# EAGLE design Driver (EAGLE 8.0.1)
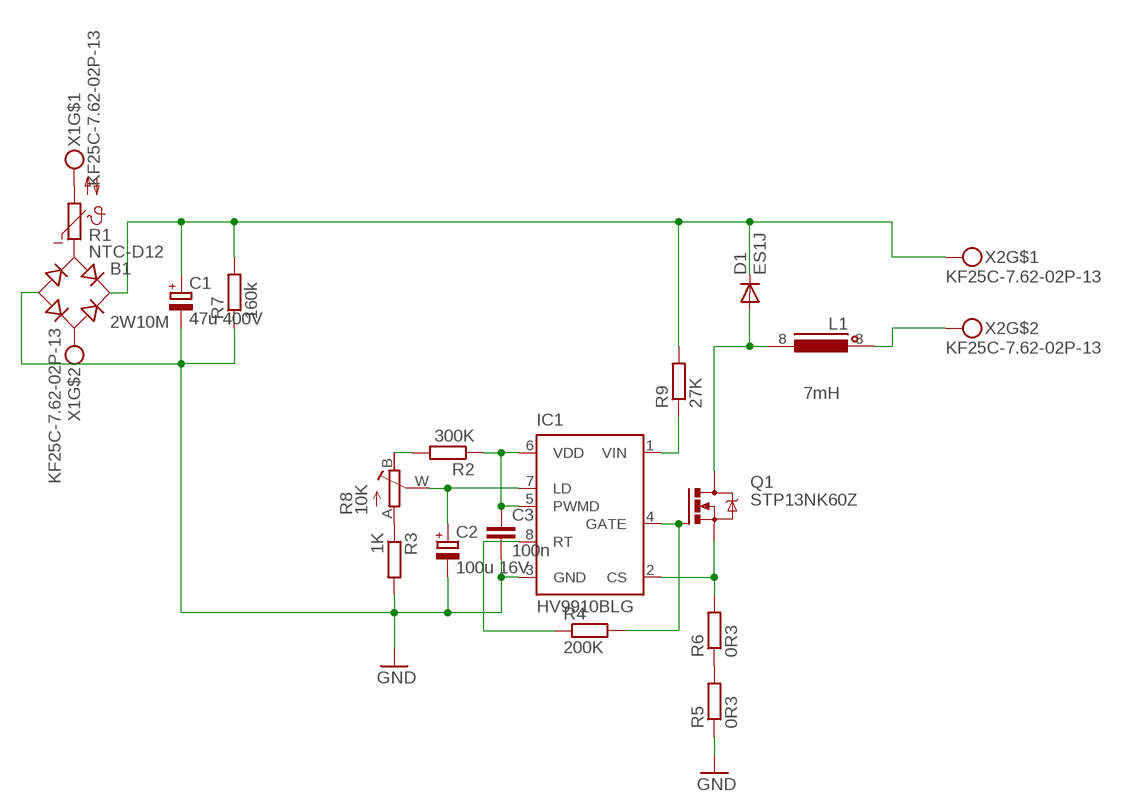
[diagram p0: schematic, sheet 1]

## Parts
B1  2W10M  RB1A  [RB1A]
C1  47u 400V  CPOL-EUE7,5-16-32-H  [E7,5-16-32-HORIZ]
C2  100u 16V  CPOL-EUE2.5-6  [E2,5-6]
C3  100n  C-EUC0805  [C0805]
D1  ES1J  DIODE-DO214AC  [DO214AC]
IC1  HV9910BLG  [SOIC-08LG]
L1  INDUCTOREE20V  [EE20_10PIN]
Q1  STP13NK60Z  IRF740  [TO220BV]
R1  NTC-D12  [NTC-D12]
R2  300K  R-EU_R0805  [R0805]
R3  1K  R-EU_R0805  [R0805]
R4  200K  R-EU_R0805  [R0805]
R5  0R3  R-EU_0414/15  [0414/15]
R6  0R3  R-EU_0414/15  [0414/15]
R7  160k  R-EU_0204/7  [0204/7]
R8  10K  R_POTTURN-X  [RJ9W]
R9  27K  R-EU_0613/15  [P0613/15]
X1  KF25C-7.62-02P-13  [KF25C-7.62-02P-13]
X2  KF25C-7.62-02P-13  [KF25C-7.62-02P-13]

## Nets
300V: B1.+ C1.+ D1.C R7.2 R9.2 X2.P$1
GND: B1.- C1.- C2.- C3.2 IC1.3(GND) R3.2 R5.1 R7.1
N$1: C3.1 IC1.5(PWMD) IC1.6(VDD) R2.1
N$2: R1.2 X1.P$1
N$3: B1.AC2 X1.P$2
N$4: B1.AC1 R1.1
N$6: L1.3 X2.P$2
N$7: C2.+ IC1.7(LD) R8.W(S)
N$8: D1.A L1.8 Q1.D
N$9: IC1.8(RT) R4.1
N$10: IC1.4(GATE) Q1.G R4.2
N$11: R5.2 R6.1
N$12: IC1.2(CS) Q1.S R6.2
N$13: R3.1 R8.A
N$14: R2.2 R8.B(E)
N$16: IC1.1(VIN) R9.1

## Notes on the sheet
- 7mH

## Library data of the parts
B1 = rectifier:RB1A: RECTIFIER 1 A
C1 C2 = rcl:CPOL-EU: POLARIZED CAPACITOR, European symbol
C3 = rcl:C-EU: CAPACITOR, European symbol
D1 = diode:DIODE-: DIODE
IC1 = supertex:HV9910B: Universal High Brightness LED Driver Source: www.supertex.com .. led_driver_ics_SG.pdf; MPN: MXHV9910B; OC_FARNELL: unknown; OC_NEWARK: 15R9731
L1 = Namenlos:INDUCTOR
Q1 = transistor-power:IRF740: N-CHANNEL MOS FET
R1 = Namenlos:NTC-D12
R2-R7 R9 = rcl:R-EU_: RESISTOR, European symbol
R8 = Namenlos:R_POT
X1 X2 = Namenlos:KF25C-7.62-02P-13

## Board
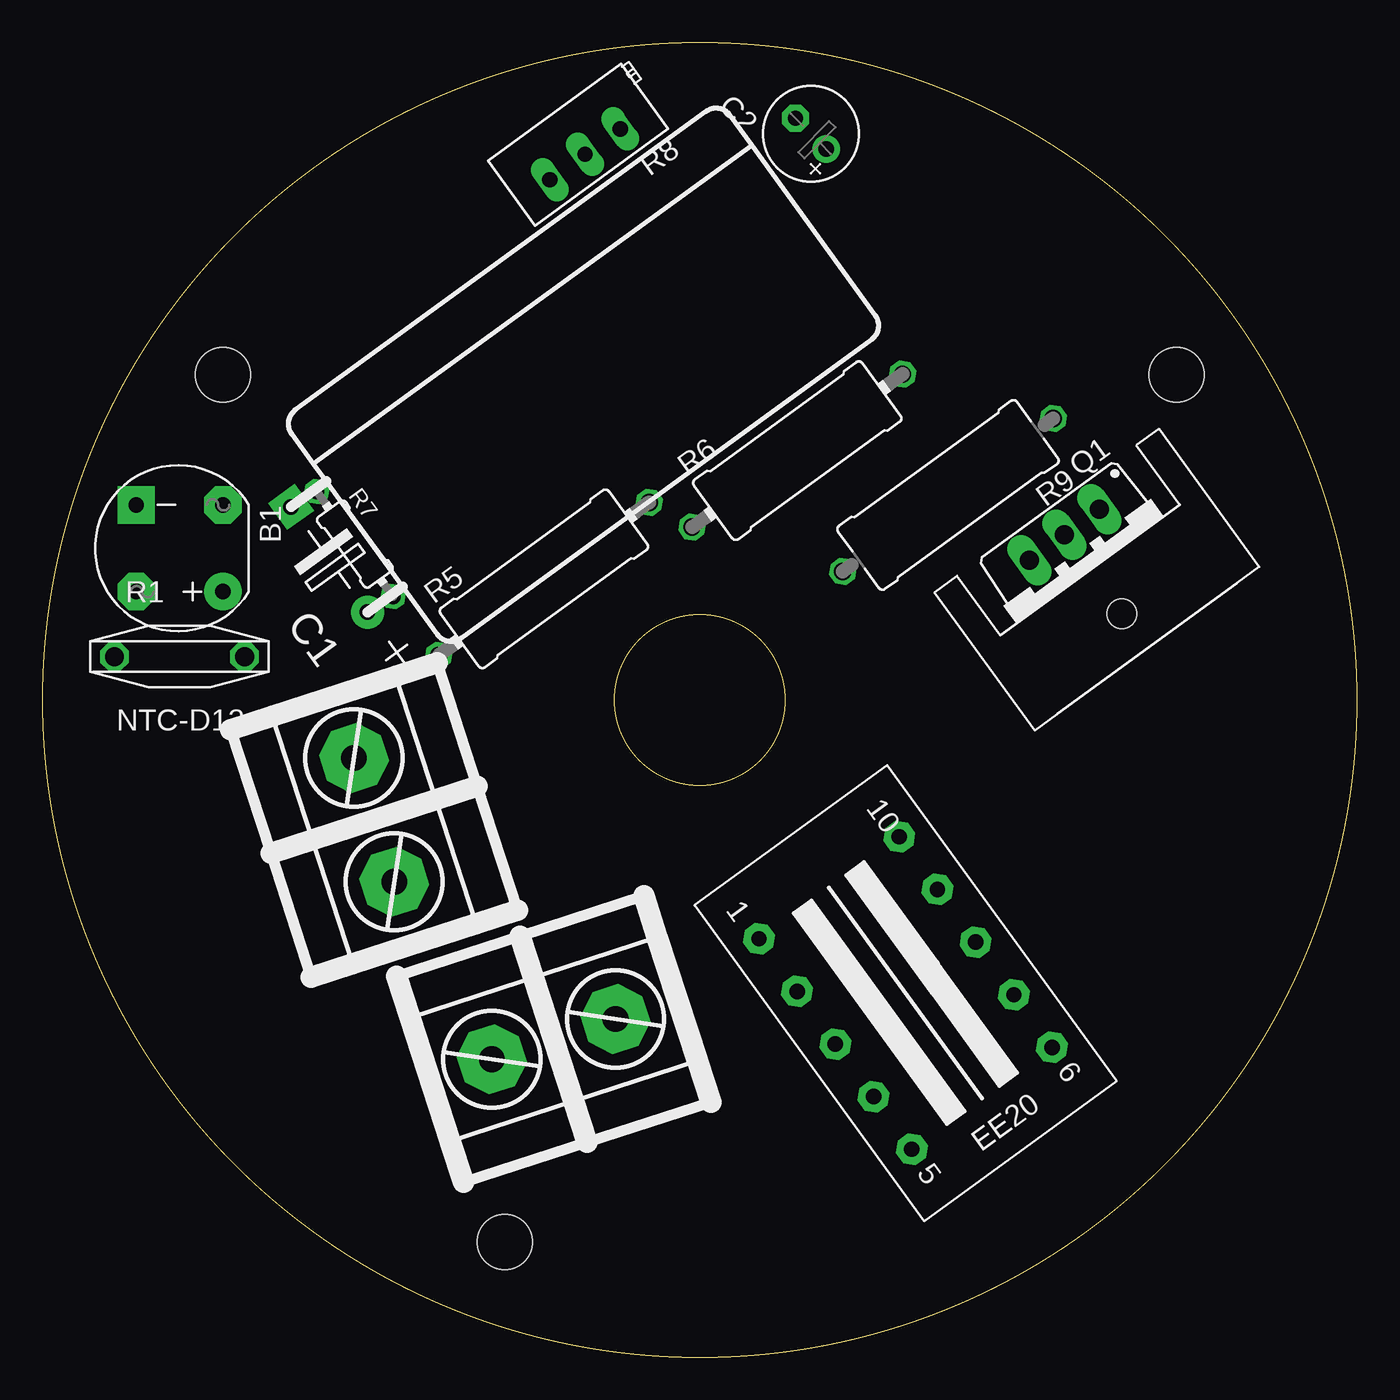
[diagram p1: board, top side]
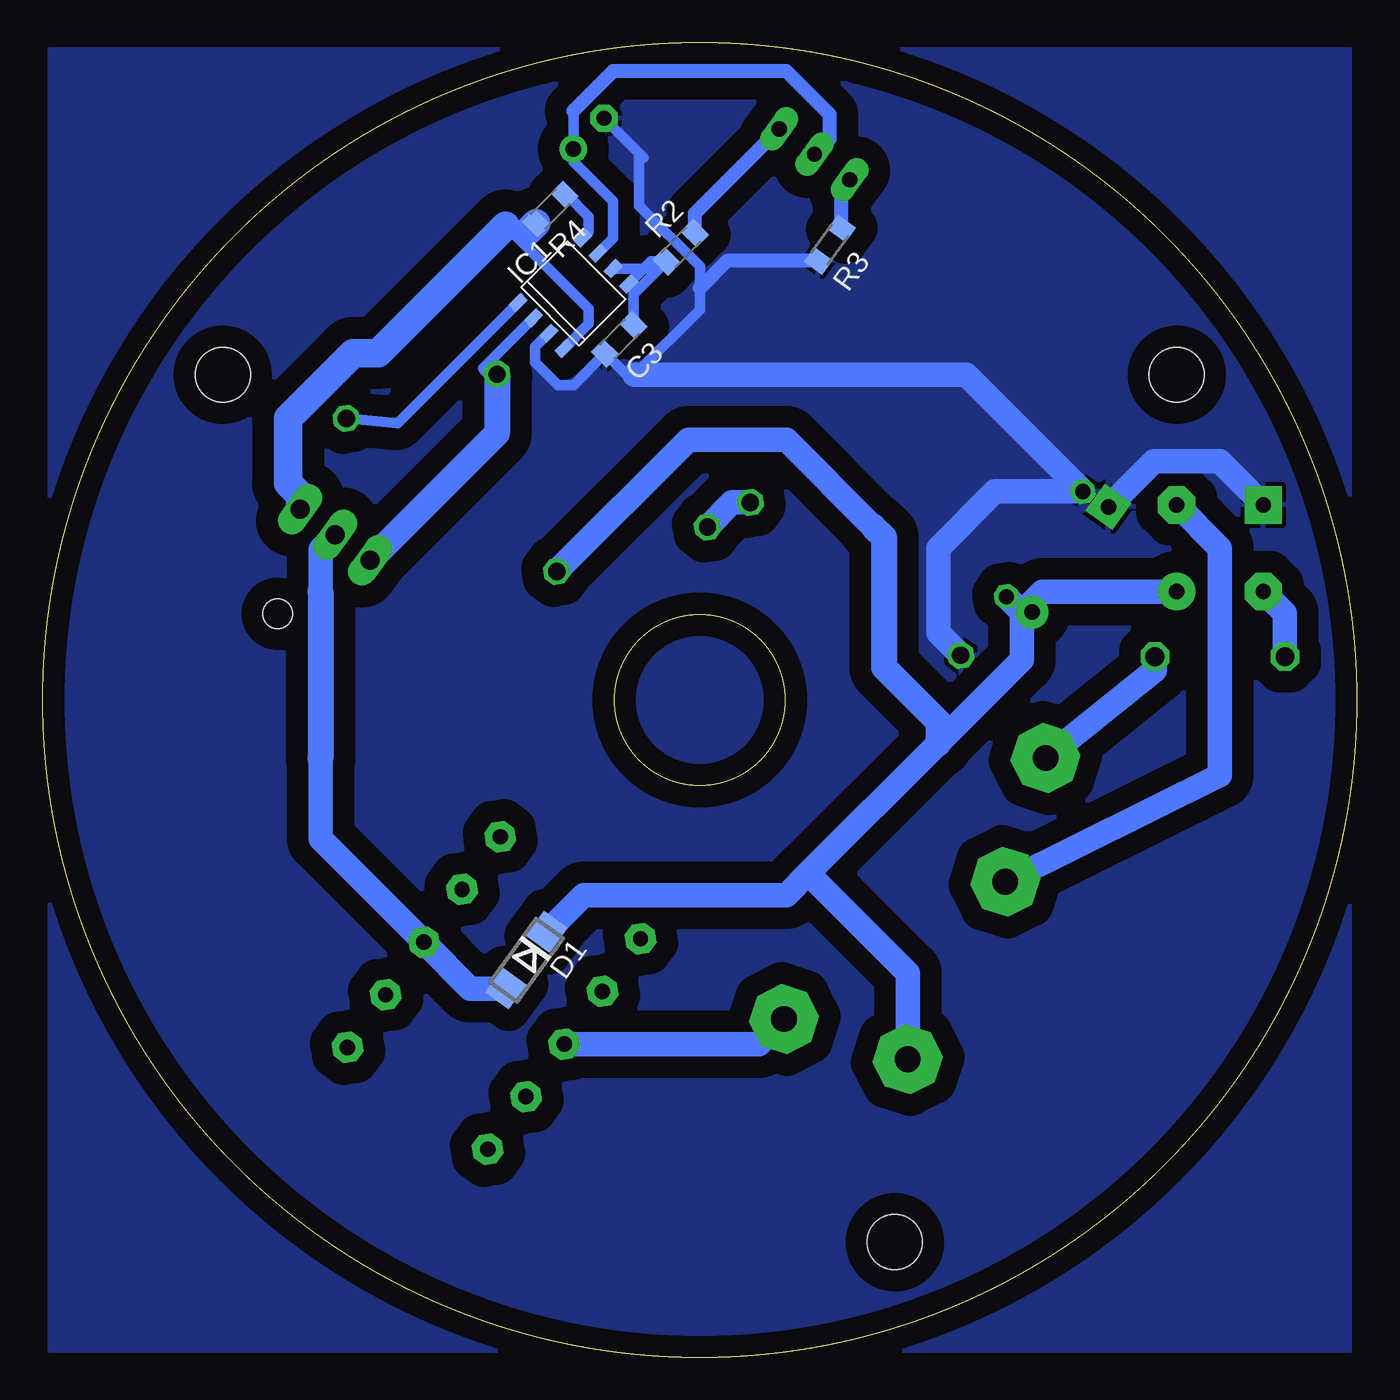
[diagram p2: board, bottom side, seen from below]

Size 77 x 77 mm. Coordinates in mm from the lower left corner, seen from the top.
Outline: circle at 38.5,38.5 radius 38.5
Outline: circle at 38.5,38.5 radius 5
Copper layers (1*16): Top 0.035mm / dielectric 1.5mm / Bottom 0.035mm
Design rules "default": minimum track width 10mil, minimum drill 24mil, track to track 8mil, track to pad 8mil, pad to pad 8mil, via to via 8mil, smd to smd 8mil, copper to edge 40mil, drill to drill 8mil, minimum pad ring 10mil, minimum via ring 8mil, stop-mask expansion 4mil, vias tented up to drill 0mil, thermal gap 10mil
Holes 3.2 mm at 10.56,57.55 66.44,57.55 27.07,6.75

### Footprints (pad centres in the part's own frame; a part is rotated, then mirrored left to right if it is on the bottom)
RB1A = drill 0.9 pad 2.184: + -2.54,2.54 | drill 0.9 pad 2.184 square: - 2.54,-2.54 | drill 0.9 pad 2.184 octagon: AC1 2.54,2.54; AC2 -2.54,-2.54
E7,5-16-32-HORIZ = drill 0.9 pad 1.93: + -3.81,0 | drill 0.9 pad 1.93 square: - 3.81,0
E2,5-6 = drill 0.9 pad 1.6: + -1.27,0 | drill 0.9 pad 1.6 octagon: - 1.27,0
C0805 = smd 1.05 x 1.3: 1 -1.175,0; 2 1.175,0
DO214AC = smd 1.8 x 1.7: A 2.05,0; C -2.05,0
SOIC-08LG = smd 0.6 x 1: 1 -1.905,-2.675; 2 -0.635,-2.675; 3 0.635,-2.675; 4 1.905,-2.675; 5 1.905,2.675; 6 0.635,2.675; 7 -0.635,2.675; 8 -1.905,2.675
EE20_10PIN = drill 0.9 pad 1.778 octagon: 1 -7.62,-4.445; 2 -3.81,-4.445; 3 0,-4.445; 4 3.81,-4.445; 5 7.62,-4.445; 6 7.62,5.715; 7 3.81,5.715; 8 0,5.715; 9 -3.81,5.715; 10 -7.62,5.715
TO220BV = drill 1.1 pad 1.422 long: D 0,-2.54; G -2.54,-2.54; S 2.54,-2.54
NTC-D12 = drill 1.1 pad 1.676 octagon: 1 -3.81,0; 2 3.81,0
R0805 = smd 1.05 x 1.3: 1 -1.175,0; 2 1.175,0
0414/15 = drill 1.016 octagon: 1 -7.62,0; 2 7.62,0
0204/7 = drill 0.9 pad 1.422 octagon: 1 -3.81,0; 2 3.81,0
RJ9W = drill 0.9 long: A 2.54,0.635; B -2.54,0.635; W 0,0.635
P0613/15 = drill 1.016 octagon: 1 -7.62,0; 2 7.62,0
SK95-3M3_HOLE = hole 1.7: 0,3.175
KF25C-7.62-02P-13 = drill 1.5 pad 3.81 octagon: P$1 -3.81,0; P$2 3.81,0

### Placement (x,y rotation side)
B1  8.02,47.39 180 top
C1  16.79,46.73 126 top
C2  45,71.67 135 top
C3  43.21,59.63 225 bottom
D1  48.66,23.26 234 bottom
IC1  45.9,62.32 315 bottom
L1  50.04,20.96 306 top
Q1  61.36,46.12 216 top
R1  8.02,41.04 0 top
R2  39.62,65.02 45 bottom
R3  30.88,65.17 234 bottom
R4  47.25,67.26 225 bottom
R5  29.37,45.6 36 top
R6  44.22,53.11 36 top
R7  18.29,47.63 306 top
R8  31.41,70.98 216 top
R9  53.05,50.51 216 top
U$1  [SK95-3M3_HOLE]  61.36,46.12 216 top
X1  19.42,31.48 288 top
X2  29.94,18.63 18 top

### Tracks (layer width: path | path; a pad name or v marks a point on that pad's centre or on a via)
300V
  Bottom 1.422: C1.+ 19.63,43.65 | 19.63,43.65 R7.2 | 19.63,43.65 18.42,44.85 B1.+ | 19.63,43.65 19.63,40.86 24.53,35.96 32.15,28.34 | R9.2 39.17,53.74 33.42,53.74 28.34,48.66 | D1.C 45.3,27.07 33.42,27.07 32.15,28.34 | X2.P$1 26.32,22.51 32.15,28.34
  Bottom 1.524: 28.34,48.66 27.7,48.03 27.7,40.41 24.53,37.23 24.53,35.96
GND
  Bottom 0.61: IC1.3 48.15,59.18 48.15,58.28 46.8,56.93 45.9,56.93 C3.2 42.79,57.55 42.31,57.55 38.5,61.36 38.5,62.63 38.5,63.9 42.05,67.45 42.05,70.51 | 41.78,70.25 42.05,70.51 | 42.05,70.51 C2.-
  Bottom 0.813: R3.2 36.91,64.22 38.5,62.63
  Bottom 1.422: R5.1 24.53,42.44 24.53,47.39 21.2,50.72 R7.1 22.89,57.55 42.31,57.55 | C1.- 11.89,52.47 8.02,52.47 B1.-
  pour Bottom (isolate 1.27): 38.5,76.6 76.6,76.6 76.6,38.5 76.6,0.4 38.5,0.4 0.4,0.4 0.4,38.5 0.4,76.6
N$1
  Bottom 0.61: 41.04,64.19 R2.1 42.38,62.25 C3.1 | 41.04,64.19 41.34,64.19 IC1.5 | IC1.6 41.46,63.76 41.04,64.19
N$2
  Bottom 1.422: X1.P$1 11.83,40.24 R1.2
N$3
  Bottom 1.422: X1.P$2 8.02,34.08 8.02,47.39 B1.AC2
N$4
  Bottom 1.422: R1.1 4.21,43.58 B1.AC1
N$6
  Bottom 1.422: L1.3 35.03,18.35 X2.P$2
N$7
  Bottom 0.61: IC1.7 43.58,65.54 43.58,67.71 45.9,70.03 C2.+ 45.9,73.01 44.85,74.06
  Bottom 0.813: R8.W 30.88,71.36 30.88,72.79 33.42,75.33 43.58,75.33 45.9,73.01
N$8
  Bottom 1.422: Q1.D 60.72,47.32 60.72,44.85 | D1.A 51.94,21.6 L1.8 60.72,30.38 60.72,35.09
  Bottom 1.524: 60.72,44.85 60.72,35.09
N$9
  Bottom 0.61: IC1.8 45,65.91 45,66.81 46.28,68.09 R4.1
N$10
  Bottom 0.61: IC1.4 45,60.53 45,61.42 49.87,66.29 48.6,65.91
  Bottom 1.676: R4.2 48.6,65.91 | 49.87,66.29 57.33,58.82 58.82,58.82 62.63,55.01 62.63,51.2 61.92,50.49 Q1.G
N$11
  Bottom 1.422: R5.2 36.6,50.08 R6.1
N$12
  Bottom 0.61: IC1.2 51.2,57.92 51.02,57.74 R6.2
  Bottom 1.524: R6.2 50.38,54.11 Q1.S
N$13
  Bottom 0.813: R3.1 30.19,68.5 R8.A
N$14
  Bottom 0.813: R2.2 38.78,67 R8.B
N$16
  Bottom 0.61: IC1.1 53.26,57.66 56.21,54.71 R9.1